# Altium schematic sheet Slow-Control-Mezz.SchDoc: Slow Control Mezz
size A; DocumentNumber: 17; SheetNumber: 17; SheetTotal: 22
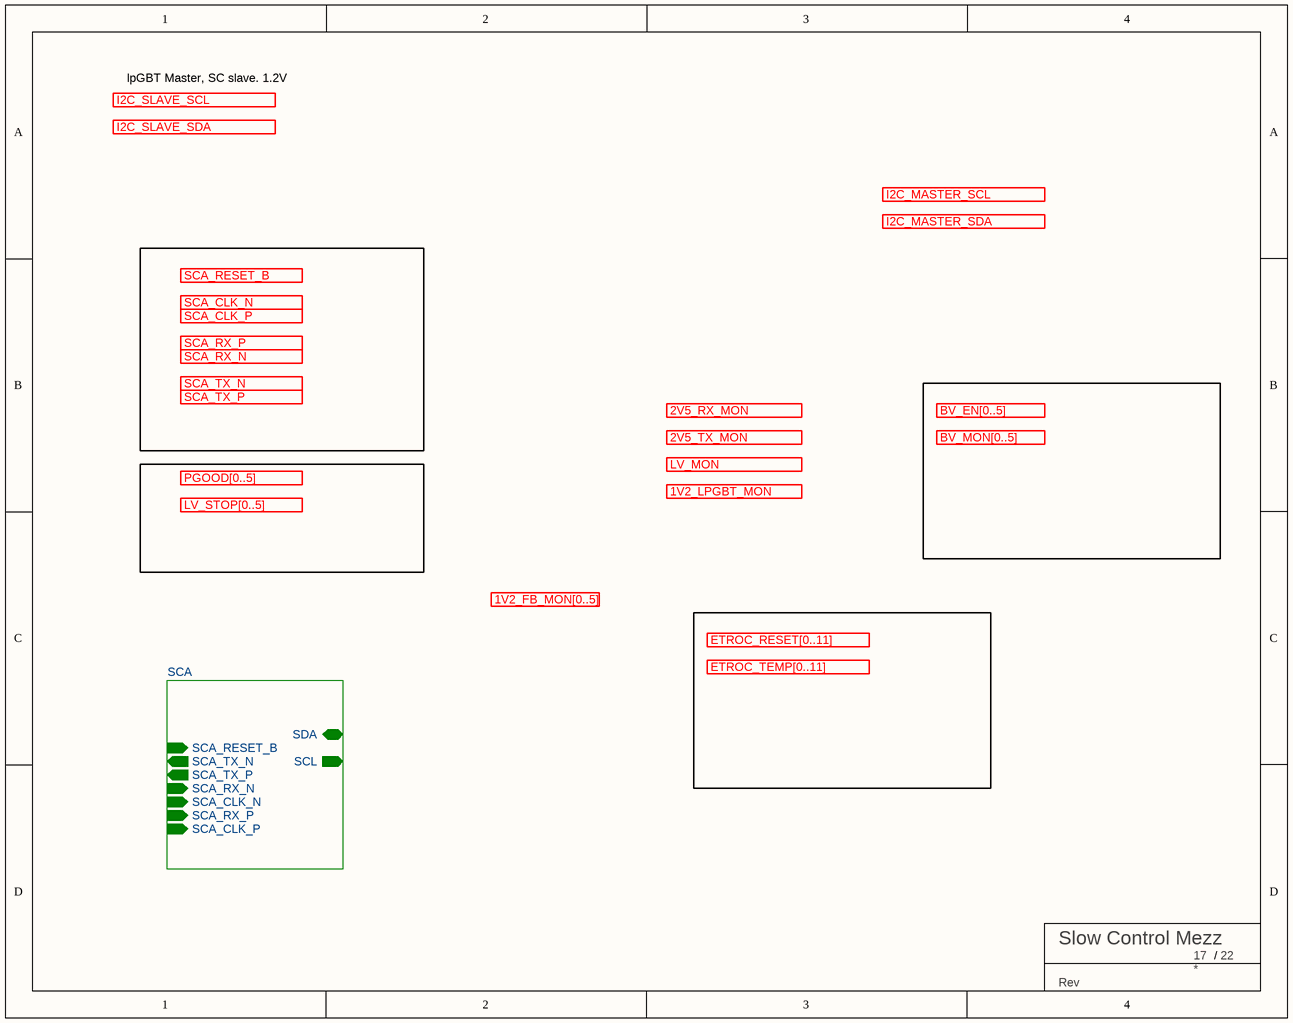
[diagram p0: Slow-Control-Mezz.SchDoc]

## Parts
TBLOCK?  BU Title block  (value not drawn)  (graphical)

## Sub-sheets
SCA = SCA-Power.SchDoc;SCA-Digital.SchDoc;SCA-Analog.SchDoc;SCA-Control.SchDoc;: SDA (bidir), SCL (out), SCA_TX_N (out), SCA_TX_P (out), SCA_RX_N (in), SCA_CLK_N (in), SCA_RX_P (in), SCA_CLK_P (in), SCA_RESET_B (in)

## Ports
1V2_FB_MON[0..5], 1V2_LPGBT_MON, 2V5_RX_MON, 2V5_TX_MON, BV_EN[0..5], BV_MON[0..5], ETROC_RESET[0..11] (out), ETROC_TEMP[0..11] (in), I2C_MASTER_SCL (out), I2C_MASTER_SDA (in), I2C_SLAVE_SCL (in), I2C_SLAVE_SDA (in), LV_MON, LV_STOP[0..5], PGOOD[0..5], SCA_CLK_N (out), SCA_CLK_P (out), SCA_RESET_B (out), SCA_RX_N (out), SCA_RX_P (out), SCA_TX_N (in), SCA_TX_P (in)

## Notes on the sheet
- lpGBT Master, SC slave. 1.2V
- (in symbol TITLE_BLOCK_BU) /; Rev

## Library data of the parts
TBLOCK? = TITLE_BLOCK_BU